# EAGLE design V-00780-01 (EAGLE 7.2.0)
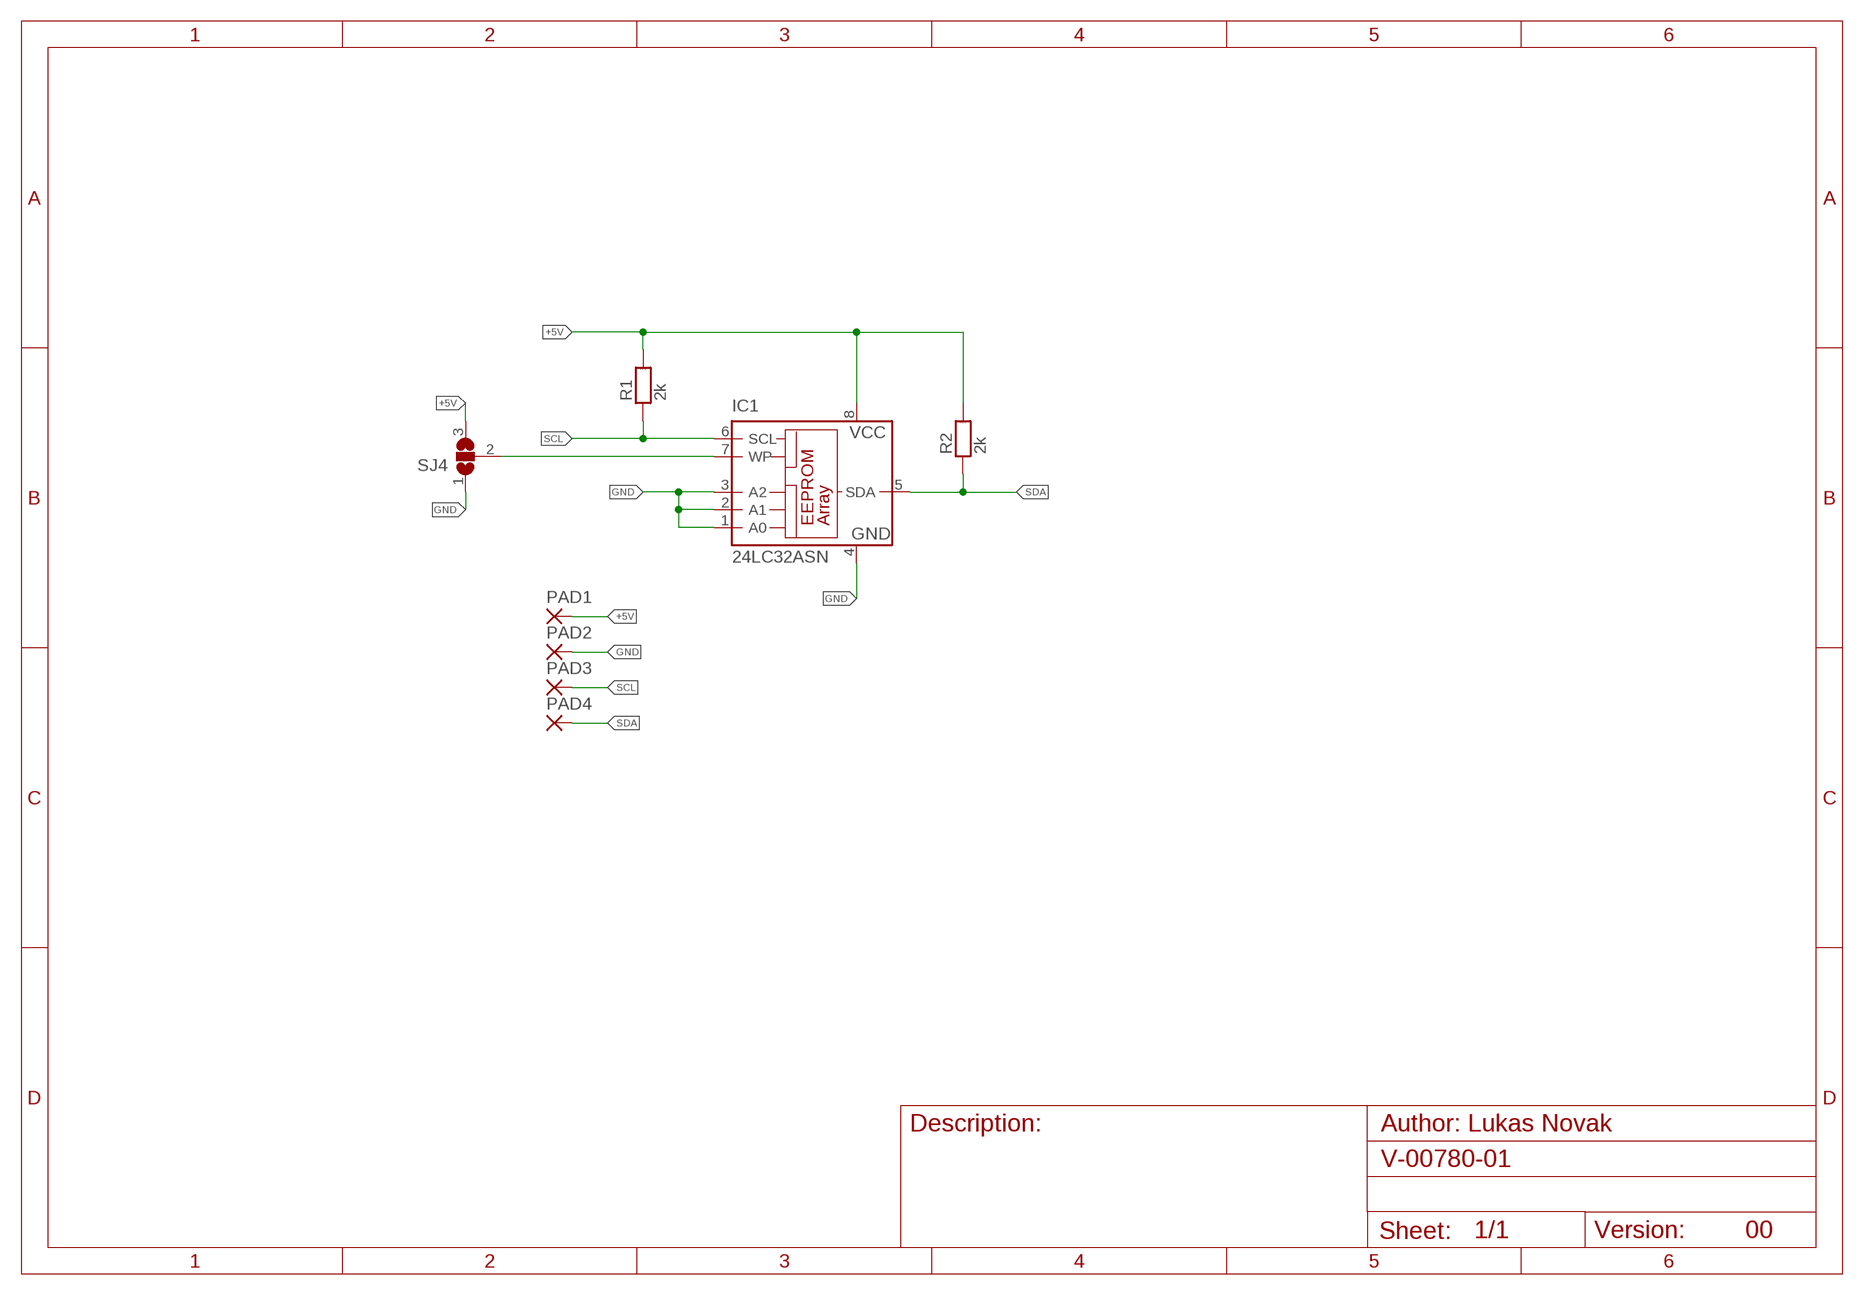
[diagram p0: schematic, sheet 1]

## Parts
IC1  24LC32ASN  [SO-08]
PAD1  SMD2  [SMD1,27-2,54]
PAD2  SMD2  [SMD1,27-2,54]
PAD3  SMD2  [SMD1,27-2,54]
PAD4  SMD2  [SMD1,27-2,54]
R1  2k  R_1206  [1206]
R2  2k  R_1206  [1206]
SJ4  SJ2W  [SJ_2]

## Nets
+5V: IC1.8(VCC) PAD1.1(P) R1.2 R2.2 SJ4.3
GND: IC1.1(A0) IC1.2(A1) IC1.3(A2) IC1.4(GND) PAD2.1(P) SJ4.1
SCL: IC1.6(SCL) PAD3.1(P) R1.1
SDA: IC1.5(SDA) PAD4.1(P) R2.1
WR_ENABLE: IC1.7(WP) SJ4.2

## Notes on the sheet
- 00

## Library data of the parts
IC1 = microchip:24*: Serial EEPROM I2C; MF: MICROCHIP; MPN: 24LC32A/SN; OC_FARNELL: 9758003; OC_NEWARK: 33C2976
PAD1-PAD4 = wirepad:SMD2: SMD PAD
R1 R2 = #PaJa_31:R: Rezistor
SJ4 = jumper:SJ2W: SMD solder JUMPER

## Board
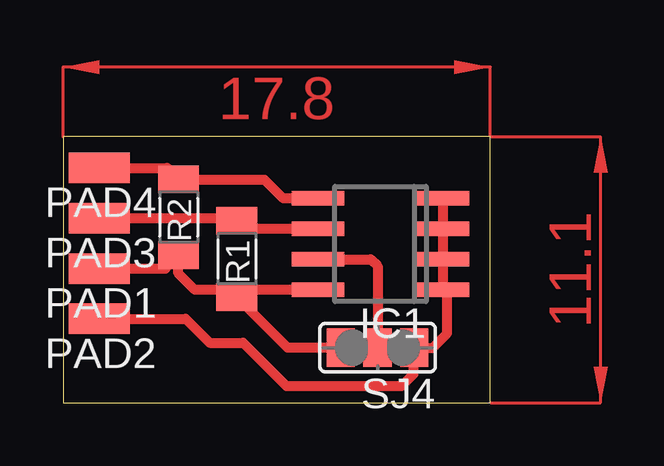
[diagram p1: board, top side]

Size 17.8 x 11.1 mm. Coordinates in mm from the lower left corner, seen from the top.
Outline: 0,0 17.8,0 17.8,11.1 0,11.1 0,0
Copper layers (1*16): Top 0.035mm / dielectric 1.5mm / Bottom 0.035mm
Design rules "default": minimum track width 10mil, minimum drill 24mil, track to track 8mil, track to pad 8mil, pad to pad 8mil, via to via 8mil, smd to smd 8mil, copper to edge 40mil, drill to drill 8mil, minimum pad ring 10mil, minimum via ring 8mil, stop-mask expansion 4mil, vias tented up to drill 0mil, thermal gap 10mil

### Footprints (pad centres in the part's own frame; a part is rotated, then mirrored left to right if it is on the bottom)
SO-08 = smd 0.6 x 2.2: 1 -1.905,-2.6; 2 -0.635,-2.6; 3 0.635,-2.6; 4 1.905,-2.6; 5 1.905,2.6; 6 0.635,2.6; 7 -0.635,2.6; 8 -1.905,2.6
SMD1,27-2,54 = smd 1.27 x 2.54: 1 0,0
1206 = smd 1.143 x 1.702: 1 -1.587,0; 2 1.587,0
SJ_2 = smd 1.168 x 1.6: 1 -1.524,0; 2 0,0; 3 1.524,0

### Placement (x,y rotation side)
IC1  13.22,6.62 90 top
PAD1  1.5,5.6 90 top
PAD2  1.5,3.5 90 top
PAD3  1.5,7.7 90 top
PAD4  1.5,9.8 90 top
R1  7.24,6 270 top
R2  4.81,7.74 270 top
SJ4  13.1,2.3 180 top

### Tracks (layer width: path | path; a pad name or v marks a point on that pad's centre or on a via)
+5V
  Top 0.406: IC1.8 7.24,4.71 | 7.24,4.71 R1.2 9.35,2.3 SJ4.3 | 7.24,4.71 5.49,4.71 4.8,5.4 R2.2 4.26,5.6 PAD1.1
GND
  Top 0.406: IC1.4 IC1.3 IC1.2 IC1.1 16,4.54 16,2.9 15.4,2.3 SJ4.1 14.6,2.28 14.6,1.2 14.1,0.7 9.3,0.7 7.5,2.5 6.1,2.5 5.1,3.5 PAD2.1
SCL
  Top 0.406: IC1.6 7.24,7.25 R1.1 7.13,7.7 PAD3.1
SDA
  Top 0.406: IC1.5 9.18,8.53 8.4,9.3 4.84,9.3 R2.1 4.34,9.8 PAD4.1
WR_ENABLE
  Top 0.406: IC1.7 12.81,5.99 13.1,5.7 SJ4.2
(copper drawn outside any net)
  shapes: Top area x2